# EAGLE design connector-32ch (EAGLE 6.5.0)
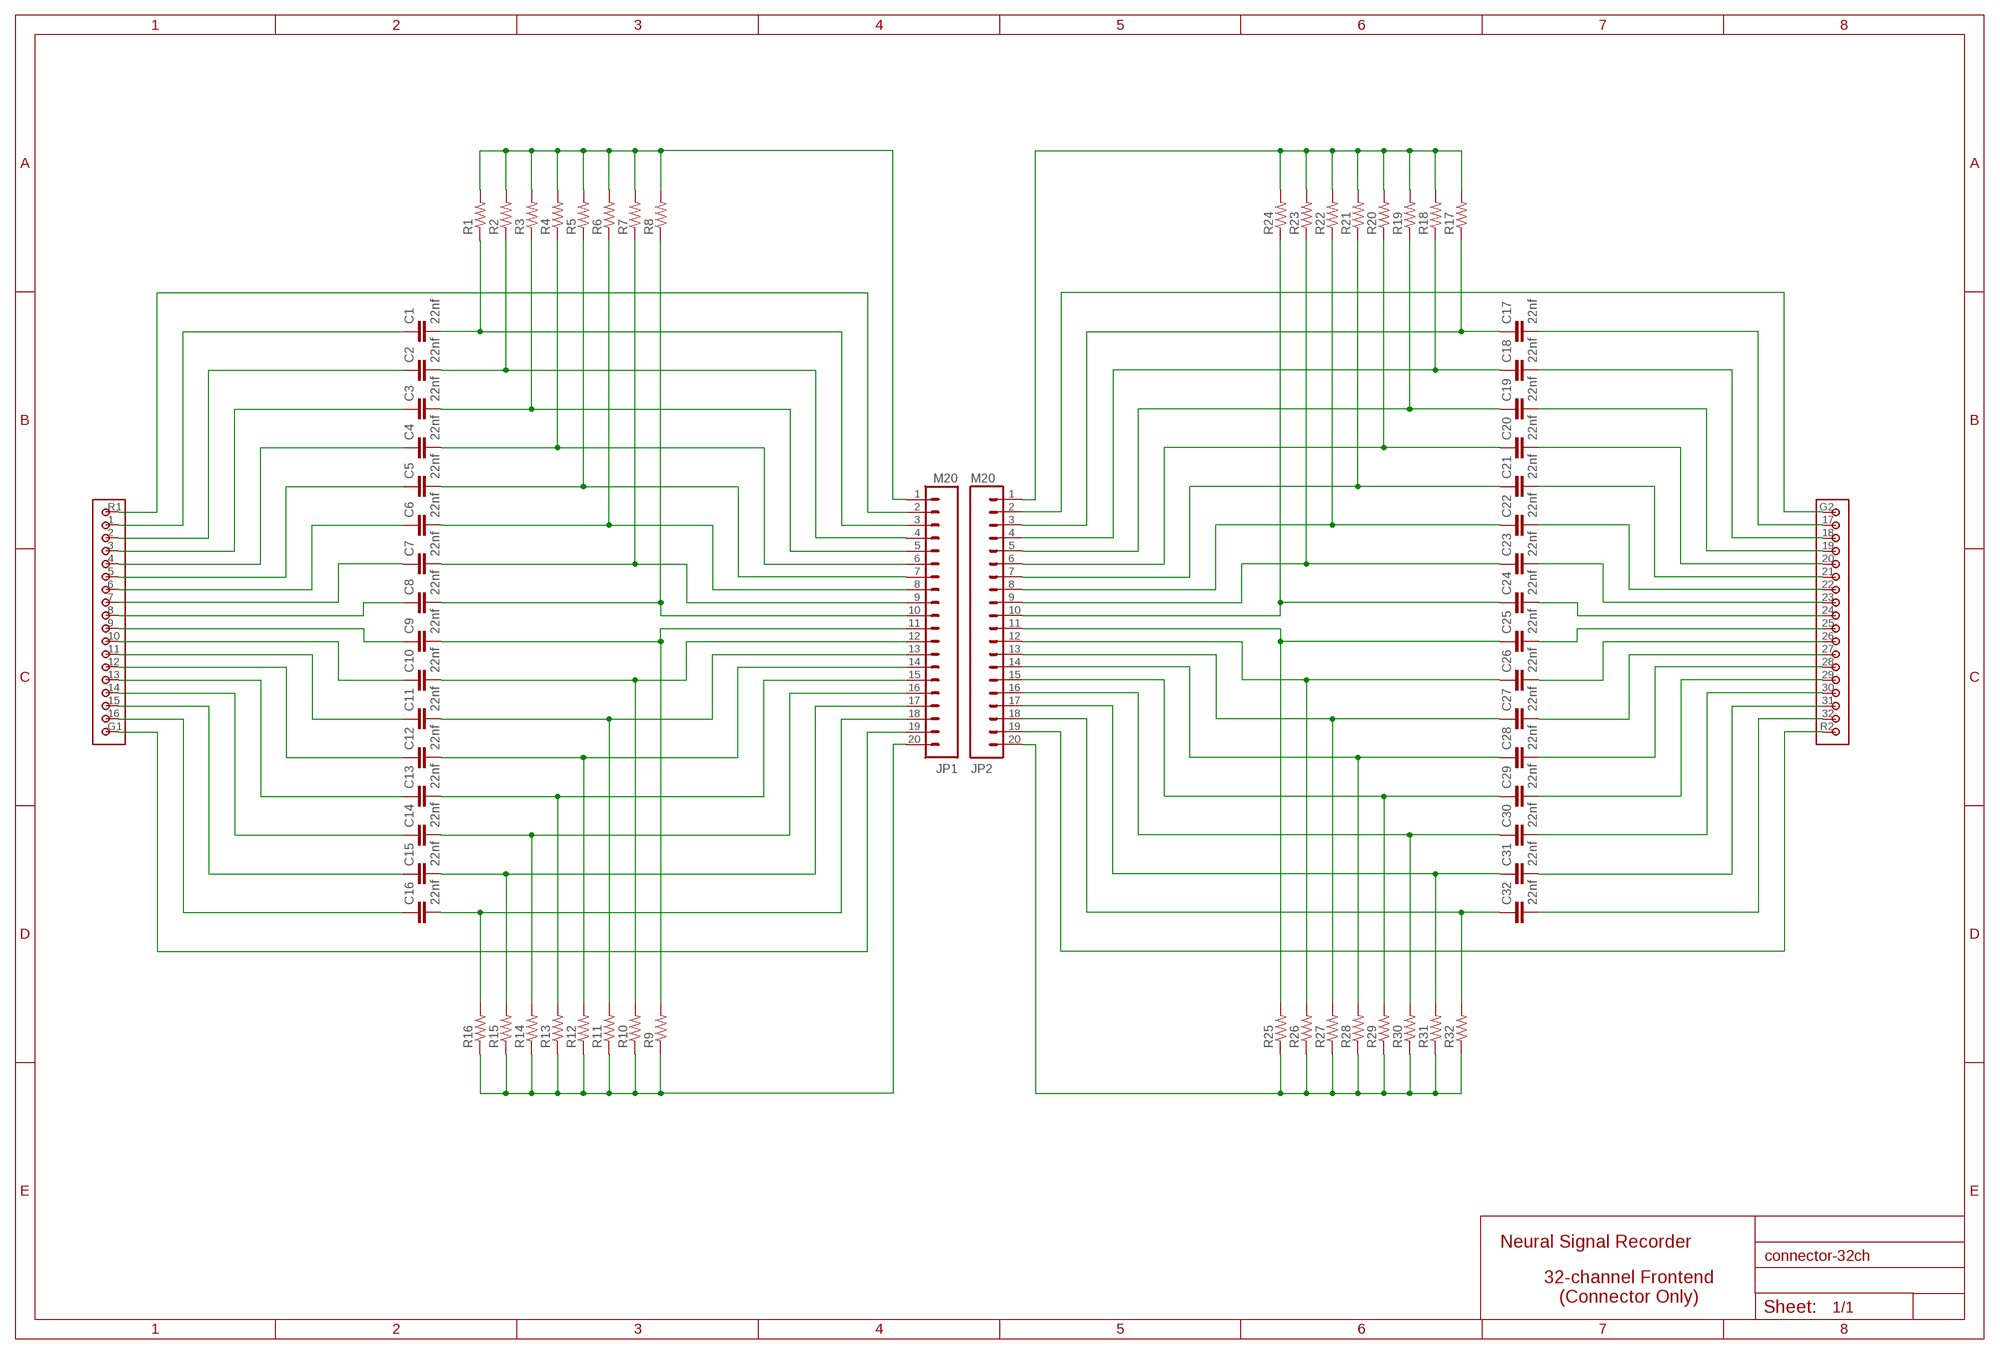
[diagram p0: schematic, sheet 1]

## Parts
C1  22nf  C-EUC0402  [C0402]
C2  22nf  C-EUC0402  [C0402]
C3  22nf  C-EUC0402  [C0402]
C4  22nf  C-EUC0402  [C0402]
C5  22nf  C-EUC0402  [C0402]
C6  22nf  C-EUC0402  [C0402]
C7  22nf  C-EUC0402  [C0402]
C8  22nf  C-EUC0402  [C0402]
C9  22nf  C-EUC0402  [C0402]
C10  22nf  C-EUC0402  [C0402]
C11  22nf  C-EUC0402  [C0402]
C12  22nf  C-EUC0402  [C0402]
C13  22nf  C-EUC0402  [C0402]
C14  22nf  C-EUC0402  [C0402]
C15  22nf  C-EUC0402  [C0402]
C16  22nf  C-EUC0402  [C0402]
C17  22nf  C-EUC0402  [C0402]
C18  22nf  C-EUC0402  [C0402]
C19  22nf  C-EUC0402  [C0402]
C20  22nf  C-EUC0402  [C0402]
C21  22nf  C-EUC0402  [C0402]
C22  22nf  C-EUC0402  [C0402]
C23  22nf  C-EUC0402  [C0402]
C24  22nf  C-EUC0402  [C0402]
C25  22nf  C-EUC0402  [C0402]
C26  22nf  C-EUC0402  [C0402]
C27  22nf  C-EUC0402  [C0402]
C28  22nf  C-EUC0402  [C0402]
C29  22nf  C-EUC0402  [C0402]
C30  22nf  C-EUC0402  [C0402]
C31  22nf  C-EUC0402  [C0402]
C32  22nf  C-EUC0402  [C0402]
JP1  M20  [1X20]
JP2  M20  [1X20]
R1  R-US_R0402  [R0402]
R2  R-US_R0402  [R0402]
R3  R-US_R0402  [R0402]
R4  R-US_R0402  [R0402]
R5  R-US_R0402  [R0402]
R6  R-US_R0402  [R0402]
R7  R-US_R0402  [R0402]
R8  R-US_R0402  [R0402]
R9  R-US_R0402  [R0402]
R10  R-US_R0402  [R0402]
R11  R-US_R0402  [R0402]
R12  R-US_R0402  [R0402]
R13  R-US_R0402  [R0402]
R14  R-US_R0402  [R0402]
R15  R-US_R0402  [R0402]
R16  R-US_R0402  [R0402]
R17  R-US_R0402  [R0402]
R18  R-US_R0402  [R0402]
R19  R-US_R0402  [R0402]
R20  R-US_R0402  [R0402]
R21  R-US_R0402  [R0402]
R22  R-US_R0402  [R0402]
R23  R-US_R0402  [R0402]
R24  R-US_R0402  [R0402]
R25  R-US_R0402  [R0402]
R26  R-US_R0402  [R0402]
R27  R-US_R0402  [R0402]
R28  R-US_R0402  [R0402]
R29  R-US_R0402  [R0402]
R30  R-US_R0402  [R0402]
R31  R-US_R0402  [R0402]
R32  R-US_R0402  [R0402]
X1  OMNETICS_36PAD  [OMNETICS36PADSMT]

## Nets
G: JP1.2 JP2.19 X1.R1 X1.R2
N$1: C8.1 X1.8
N$2: C9.1 X1.9
N$3: C7.1 X1.7
N$4: C6.1 X1.6
N$5: C5.1 X1.5
N$6: C4.1 X1.4
N$7: C3.1 X1.3
N$8: C2.1 X1.2
N$9: C1.1 X1.1
N$10: C10.1 X1.10
N$11: C11.1 X1.11
N$12: C12.1 X1.12
N$13: C13.1 X1.13
N$14: C14.1 X1.14
N$15: C15.1 X1.15
N$16: C16.1 X1.16
N$17: C24.2 X1.24
N$18: C25.2 X1.25
N$19: C23.2 X1.23
N$20: C22.2 X1.22
N$21: C21.2 X1.21
N$22: C20.2 X1.20
N$23: C19.2 X1.19
N$24: C18.2 X1.18
N$25: C17.2 X1.17
N$26: C26.2 X1.26
N$27: C27.2 X1.27
N$28: C28.2 X1.28
N$29: C29.2 X1.29
N$30: C30.2 X1.30
N$31: C31.2 X1.31
N$32: C32.2 X1.32
N$33: C1.2 JP1.3 R1.1
N$34: C2.2 JP1.4 R2.1
N$35: C3.2 JP1.5 R3.1
N$36: C4.2 JP1.6 R4.1
N$37: C5.2 JP1.7 R5.1
N$38: C6.2 JP1.8 R6.1
N$39: C7.2 JP1.9 R7.1
N$40: C8.2 JP1.10 R8.1
N$41: C9.2 JP1.11 R9.2
N$42: C10.2 JP1.12 R10.2
N$43: C11.2 JP1.13 R11.2
N$44: C12.2 JP1.14 R12.2
N$45: C13.2 JP1.15 R13.2
N$46: C14.2 JP1.16 R14.2
N$47: C15.2 JP1.17 R15.2
N$48: C16.2 JP1.18 R16.2
N$49: C17.1 JP2.3 R17.1
N$50: C18.1 JP2.4 R18.1
N$51: C19.1 JP2.5 R19.1
N$52: C20.1 JP2.6 R20.1
N$53: C21.1 JP2.7 R21.1
N$54: C22.1 JP2.8 R22.1
N$55: C23.1 JP2.9 R23.1
N$56: C24.1 JP2.10 R24.1
N$57: C25.1 JP2.11 R25.2
N$58: C26.1 JP2.12 R26.2
N$59: C27.1 JP2.13 R27.2
N$60: C28.1 JP2.14 R28.2
N$61: C29.1 JP2.15 R29.2
N$62: C30.1 JP2.16 R30.2
N$63: C31.1 JP2.17 R31.2
N$64: C32.1 JP2.18 R32.2
R: JP1.19 JP2.2 X1.G1 X1.G2
VCM: JP1.1 JP1.20 JP2.1 JP2.20 R1.2 R2.2 R3.2 R4.2 R5.2 R6.2 R7.2 R8.2 R9.1 R10.1 R11.1 R12.1 R13.1 R14.1 R15.1 R16.1 R17.2 R18.2 R19.2 R20.2 R21.2 R22.2 R23.2 R24.2 R25.1 R26.1 R27.1 R28.1 R29.1 R30.1 R31.1 R32.1

## Notes on the sheet
- Neural Signal Recorder
- 32-channel Frontend
  (Connector Only)

## Library data of the parts
C1-C32 = rcl:C-EU: CAPACITOR, European symbol
JP1 JP2 = mor307:M20: 1x20 .05" header
R1-R32 = rcl:R-US_: RESISTOR, American symbol
X1 = mor307:OMNETICS_36PAD: Omnetics 36 pad Neural Signal Connector PTH Part Number: A79023-001

## Board
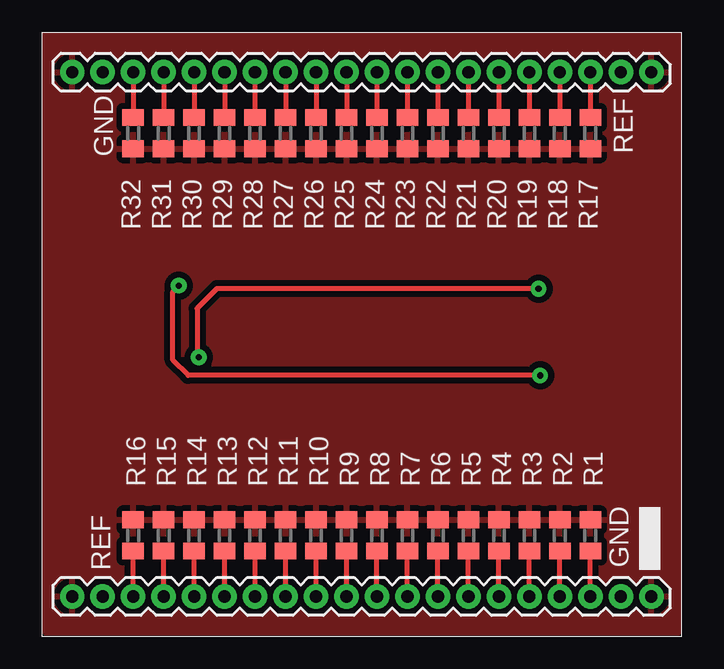
[diagram p1: board, top side]
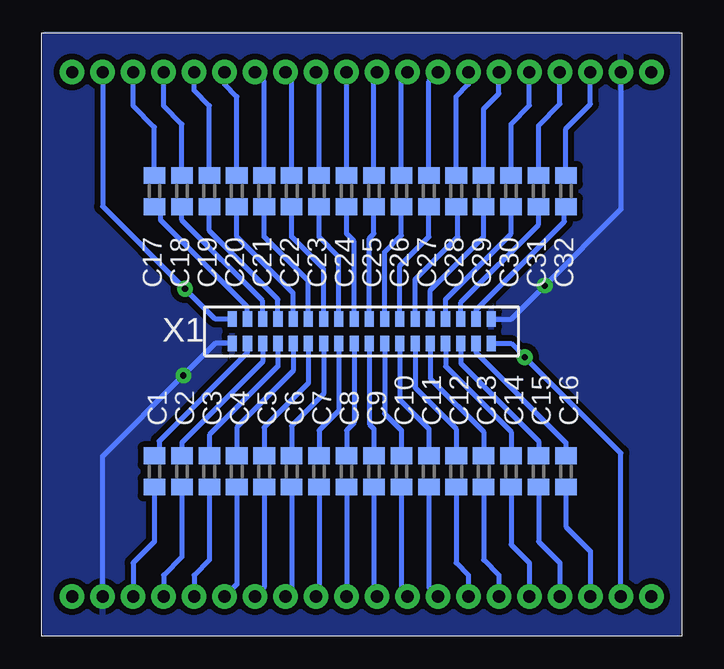
[diagram p2: board, bottom side, seen from below]

No outline drawn. Coordinates in mm, seen from the top.
Copper layers (1*16): Top 0.035mm / dielectric 1.5mm / Bottom 0.035mm
Design rules "advancedcircuits": minimum track width 8mil, minimum drill 10mil, track to track 10mil, track to pad 10mil, pad to pad 10mil, via to via 10mil, smd to smd 10mil, copper to edge 10mil, drill to drill 8mil, minimum pad ring 2.5mil, minimum via ring 2.5mil, stop-mask expansion 4mil, vias tented up to drill 0mil, thermal gap 10mil

### Footprints (pad centres in the part's own frame; a part is rotated, then mirrored left to right if it is on the bottom)
C0402 = smd 0.7 x 0.9: 1 -0.65,0; 2 0.65,0
1X20 = drill 0.508 pad 1.016: 1 0,0; 2 1.27,0; 3 2.54,0; 4 3.81,0; 5 5.08,0; 6 6.35,0; 7 7.62,0; 8 8.89,0; 9 10.16,0; 10 11.43,0; 11 12.7,0; 12 13.97,0; 13 15.24,0; 14 16.51,0; 15 17.78,0; 16 19.05,0; 17 20.32,0; 18 21.59,0; 19 22.86,0; 20 24.13,0
R0402 = smd 0.7 x 0.9: 1 -0.65,0; 2 0.65,0
OMNETICS36PADSMT = smd 0.381 x 0.635: 1 -4.763,-0.508; 2 -4.128,-0.508; 3 -3.493,-0.508; 4 -2.857,-0.508; 5 -2.223,-0.508; 6 -1.587,-0.508; 7 -0.953,-0.508; 8 -0.318,-0.508; 9 0.318,-0.508; 10 0.953,-0.508; 11 1.587,-0.508; 12 2.223,-0.508; 13 2.857,-0.508; 14 3.493,-0.508; 15 4.128,-0.508; 16 4.763,-0.508; 17 -4.763,0.508; 18 -4.128,0.508; 19 -3.493,0.508; 20 -2.857,0.508; 21 -2.223,0.508; 22 -1.587,0.508; 23 -0.953,0.508; 24 -0.318,0.508; 25 0.318,0.508; 26 0.953,0.508; 27 1.587,0.508; 28 2.223,0.508; 29 2.857,0.508; 30 3.493,0.508; 31 4.128,0.508; 32 4.763,0.508; G1 5.397,-0.508; G2 -5.397,0.508; R1 -5.397,-0.508; R2 5.397,0.508

### Placement (x,y rotation side)
C1  21.97,6.86 270 bottom
C2  20.83,6.86 270 bottom
C3  19.68,6.86 270 bottom
C4  18.54,6.86 270 bottom
C5  17.4,6.86 270 bottom
C6  16.26,6.86 270 bottom
C7  15.11,6.86 270 bottom
C8  13.97,6.86 270 bottom
C9  12.83,6.86 270 bottom
C10  11.68,6.86 270 bottom
C11  10.54,6.86 270 bottom
C12  9.4,6.86 270 bottom
C13  8.26,6.86 270 bottom
C14  7.11,6.86 270 bottom
C15  5.97,6.86 270 bottom
C16  4.83,6.86 270 bottom
C17  21.97,18.54 270 bottom
C18  20.83,18.54 270 bottom
C19  19.68,18.54 270 bottom
C20  18.54,18.54 270 bottom
C21  17.4,18.54 270 bottom
C22  16.26,18.54 270 bottom
C23  15.11,18.54 270 bottom
C24  13.97,18.54 270 bottom
C25  12.83,18.54 270 bottom
C26  11.68,18.54 270 bottom
C27  10.54,18.54 270 bottom
C28  9.4,18.54 270 bottom
C29  8.26,18.54 270 bottom
C30  7.11,18.54 270 bottom
C31  5.97,18.54 270 bottom
C32  4.83,18.54 270 bottom
JP1  25.4,1.65 180 top
JP2  25.4,23.5 180 top
R1  22.86,4.19 90 top
R2  21.59,4.19 90 top
R3  20.32,4.19 90 top
R4  19.05,4.19 90 top
R5  17.78,4.19 90 top
R6  16.51,4.19 90 top
R7  15.24,4.19 90 top
R8  13.97,4.19 90 top
R9  12.7,4.19 270 top
R10  11.43,4.19 270 top
R11  10.16,4.19 270 top
R12  8.89,4.19 270 top
R13  7.62,4.19 270 top
R14  6.35,4.19 270 top
R15  5.08,4.19 270 top
R16  3.81,4.19 270 top
R17  22.86,20.95 270 top
R18  21.59,20.95 270 top
R19  20.32,20.95 270 top
R20  19.05,20.95 270 top
R21  17.78,20.95 270 top
R22  16.51,20.95 270 top
R23  15.24,20.95 270 top
R24  13.97,20.95 270 top
R25  12.7,20.95 90 top
R26  11.43,20.95 90 top
R27  10.16,20.95 90 top
R28  8.89,20.95 90 top
R29  7.62,20.95 90 top
R30  6.35,20.95 90 top
R31  5.08,20.95 90 top
R32  3.81,20.95 90 top
X1  13.34,12.7 0 bottom

### Tracks (layer width: path | path; a pad name or v marks a point on that pad's centre or on a via)
G  (via drill 0.25 pad 0.66)
  Top 0.203: v20.77,10.86 6.1,10.86 5.46,11.49 5.46,14.35 v5.71,14.61
  Bottom 0.203: JP1.2 24.13,7.49 v20.77,10.86 19.43,12.19 X1.R1 | JP2.19 2.54,17.78 v5.71,14.61 7.11,13.21 X1.R2
  pour Bottom: 0.19,25.08 26.54,25.08 26.54,0.13 0.13,0.13 0.13,25.08
N$1
  Bottom 0.203: X1.8 13.65,8.89 13.97,8.57 C8.1
N$2
  Bottom 0.203: X1.9 13.02,8.83 12.83,8.64 C9.1
N$3
  Bottom 0.203: X1.7 14.29,9.4 15.11,8.57 C7.1
N$4
  Bottom 0.203: X1.6 14.92,10.1 16.26,8.76 C6.1
N$5
  Bottom 0.203: X1.5 15.56,10.54 17.4,8.7 C5.1
N$6
  Bottom 0.203: X1.4 16.19,11.05 18.54,8.7 C4.1
N$7
  Bottom 0.203: X1.3 16.83,11.24 19.68,8.38 C3.1
N$8
  Bottom 0.203: X1.2 17.46,11.43 20.83,8.06 C2.1
N$9
  Bottom 0.203: X1.1 18.1,11.81 21.78,8.13 21.78,7.7 C1.1
N$10
  Bottom 0.203: X1.10 12.38,9.27 11.68,8.57 C10.1
N$11
  Bottom 0.203: X1.11 11.75,9.84 10.54,8.64 C11.1
N$12
  Bottom 0.203: X1.12 11.11,10.35 9.4,8.64 C12.1
N$13
  Bottom 0.203: X1.13 10.48,10.73 8.26,8.51 C13.1
N$14
  Bottom 0.203: X1.14 9.84,11.24 7.11,8.51 C14.1
N$15
  Bottom 0.203: X1.15 9.21,11.37 5.97,8.13 C15.1
N$16
  Bottom 0.203: X1.16 8.57,11.81 4.83,8.06 C16.1
N$17
  Bottom 0.203: X1.24 13.65,16.45 13.97,16.76 C24.2
N$18
  Bottom 0.203: X1.25 13.02,16.57 12.83,16.76 C25.2
N$19
  Bottom 0.203: X1.23 14.29,15.81 15.11,16.64 C23.2
N$20
  Bottom 0.203: X1.22 14.92,15.3 16.26,16.64 C22.2
N$21
  Bottom 0.203: X1.21 15.56,14.8 17.4,16.64 C21.2
N$22
  Bottom 0.203: X1.20 16.19,14.29 18.54,16.64 C20.2
N$23
  Bottom 0.203: X1.19 16.83,14.03 19.68,16.89 C19.2
N$24
  Bottom 0.203: X1.18 17.46,13.97 20.83,17.34 C18.2
N$25
  Bottom 0.203: X1.17 18.1,13.72 21.72,17.34 21.72,17.64 C17.2
N$26
  Bottom 0.203: X1.26 12.38,16 11.68,16.7 C26.2
N$27
  Bottom 0.203: X1.27 11.75,15.43 10.54,16.64 C27.2
N$28
  Bottom 0.203: X1.28 11.11,14.86 9.34,16.64 9.34,17.83 C28.2
N$29
  Bottom 0.203: X1.29 10.48,14.41 8.26,16.64 C29.2
N$30
  Bottom 0.203: X1.30 9.84,14.03 7.11,16.76 C30.2
N$31
  Bottom 0.203: X1.31 9.21,13.91 5.97,17.14 C31.2
N$32
  Bottom 0.203: X1.32 8.57,13.59 4.89,17.27 4.89,17.83 C32.2
N$33
  Top 0.203: JP1.3 R1.1
  Bottom 0.203: C1.2 21.97,3.94 22.86,3.05 JP1.3
N$34
  Top 0.203: JP1.4 R2.1
  Bottom 0.203: C2.2 20.83,3.3 21.59,2.54 JP1.4
N$35
  Top 0.203: JP1.5 R3.1
  Bottom 0.203: C3.2 19.68,3.17 20.32,2.54 JP1.5
N$36
  Top 0.203: JP1.6 R4.1
  Bottom 0.203: C4.2 18.54,2.16 JP1.6
N$37
  Top 0.203: JP1.7 R5.1
  Bottom 0.203: C5.2 17.4,2.03 JP1.7
N$38
  Top 0.203: JP1.8 R6.1
  Bottom 0.203: C6.2 16.26,1.91 JP1.8
N$39
  Top 0.203: JP1.9 R7.1
  Bottom 0.203: C7.2 15.11,1.78 JP1.9
N$40
  Top 0.203: JP1.10 R8.1
  Bottom 0.203: C8.2 JP1.10
N$41
  Top 0.203: JP1.11 R9.2
  Bottom 0.203: C9.2 12.83,1.78 JP1.11
N$42
  Top 0.203: JP1.12 R10.2
  Bottom 0.203: C10.2 11.68,1.91 JP1.12
N$43
  Top 0.203: JP1.13 R11.2
  Bottom 0.203: C11.2 10.54,2.03 JP1.13
N$44
  Top 0.203: JP1.14 R12.2
  Bottom 0.203: C12.2 9.4,3.05 8.89,2.54 JP1.14
N$45
  Top 0.203: JP1.15 R13.2
  Bottom 0.203: C13.2 8.26,3.17 7.62,2.54 JP1.15
N$46
  Top 0.203: JP1.16 R14.2
  Bottom 0.203: C14.2 7.11,3.81 6.35,3.05 JP1.16
N$47
  Top 0.203: JP1.17 R15.2
  Bottom 0.203: C15.2 5.97,3.94 5.08,3.05 JP1.17
N$48
  Top 0.203: JP1.18 R16.2
  Bottom 0.203: C16.2 4.83,4.56 R16.2 JP1.18
N$49
  Top 0.203: JP2.3 R17.1
  Bottom 0.203: C17.1 21.97,21.21 22.86,22.1 JP2.3
N$50
  Top 0.203: JP2.4 R18.1
  Bottom 0.203: C18.1 20.83,21.34 21.59,22.1 JP2.4
N$51
  Top 0.203: JP2.5 R19.1
  Bottom 0.203: C19.1 19.68,22.1 20.32,22.73 JP2.5
N$52
  Top 0.203: JP2.6 R20.1
  Bottom 0.203: C20.1 18.54,22.48 19.05,22.99 JP2.6
N$53
  Top 0.203: JP2.7 R21.1
  Bottom 0.203: C21.1 17.4,23.11 JP2.7
N$54
  Top 0.203: JP2.8 R22.1
  Bottom 0.203: C22.1 16.26,23.24 JP2.8
N$55
  Top 0.203: JP2.9 R23.1
  Bottom 0.203: C23.1 15.11,23.37 JP2.9
N$56
  Top 0.203: JP2.10 R24.1
  Bottom 0.203: C24.1 JP2.10
N$57
  Top 0.203: JP2.11 R25.2
  Bottom 0.203: C25.1 12.83,23.37 JP2.11
N$58
  Top 0.203: JP2.12 R26.2
  Bottom 0.203: C26.1 11.68,23.24 JP2.12
N$59
  Top 0.203: JP2.13 R27.2
  Bottom 0.203: C27.1 10.54,23.11 JP2.13
N$60
  Top 0.203: 8.89,21.46 R28.2 JP2.14
  Bottom 0.203: C28.1 9.4,22.48 8.89,22.99 JP2.14
N$61
  Top 0.203: JP2.15 R29.2
  Bottom 0.203: C29.1 8.26,21.97 7.62,22.61 JP2.15
N$62
  Top 0.203: JP2.16 R30.2
  Bottom 0.203: C30.1 7.11,21.34 6.35,22.1 JP2.16
N$63
  Top 0.203: JP2.17 R31.2
  Bottom 0.203: C31.1 5.97,21.27 5.08,22.16 JP2.17
N$64
  Top 0.203: JP2.18 R32.2
  Bottom 0.203: C32.1 4.83,21.14 3.81,22.16 JP2.18
R  (via drill 0.25 pad 0.66)
  Top 0.203: v20.7,14.48 7.3,14.48 6.48,13.65 6.48,11.68 v6.54,11.62
  Bottom 0.203: JP2.2 24.13,17.91 v20.7,14.48 19.43,13.21 X1.G2 | JP1.19 2.54,7.62 v6.54,11.62 7.11,12.19 X1.G1
VCM
  pour Top: 0.13,25.08 26.54,25.08 26.54,0.13 0.13,0.13

### Text on the board
tNames: GND | REF | REF | GND